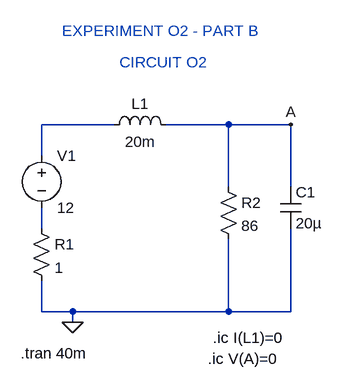
[diagram p0: schematic LTSPICE_CIRCUITO2.asc]
LTSPICE_CIRCUITO2.asc, the LTspice schematic file:
Version 4
SHEET 1 880 680
WIRE 192 0 80 0
WIRE 368 0 272 0
WIRE 464 0 368 0
WIRE 80 48 80 0
WIRE 368 96 368 0
WIRE 464 96 464 0
WIRE 80 160 80 128
WIRE 80 288 80 240
WIRE 128 288 80 288
WIRE 368 288 368 176
WIRE 368 288 128 288
WIRE 464 288 464 160
WIRE 464 288 368 288
WIRE 128 304 128 288
FLAG 128 304 0
FLAG 464 0 A
SYMBOL res 64 144 R0
SYMATTR InstName R1
SYMATTR Value 1
SYMBOL voltage 80 32 R0
WINDOW 123 0 0 Left 0
WINDOW 39 0 0 Left 0
SYMATTR InstName V1
SYMATTR Value 12
SYMBOL ind 176 16 R270
WINDOW 0 32 56 VTop 2
WINDOW 3 5 56 VBottom 2
SYMATTR InstName L1
SYMATTR Value 20m
SYMBOL res 352 80 R0
SYMATTR InstName R2
SYMATTR Value 86
SYMBOL cap 448 96 R0
SYMATTR InstName C1
SYMATTR Value 20µ
TEXT 344 328 Left 2 !.ic I(L1)=0
TEXT 336 360 Left 2 !.ic V(A)=0
TEXT 48 352 Left 2 !.tran 40m
TEXT 112 -144 Left 2 ;EXPERIMENT O2 - PART B
TEXT 200 -96 Left 2 ;CIRCUIT O2

The netlist it stands for:
* LTSPICE_CIRCUITO2.asc
R1 N002 0 1
V1 N001 N002 12
L1 N001 A 20m
R2 A 0 86
C1 A 0 20µ
.ic I(L1)=0
.ic V(A)=0
.tran 40m
* EXPERIMENT O2 - PART B
* CIRCUIT O2
.backanno
.end